# EAGLE design prototype (EAGLE 9.4.2)
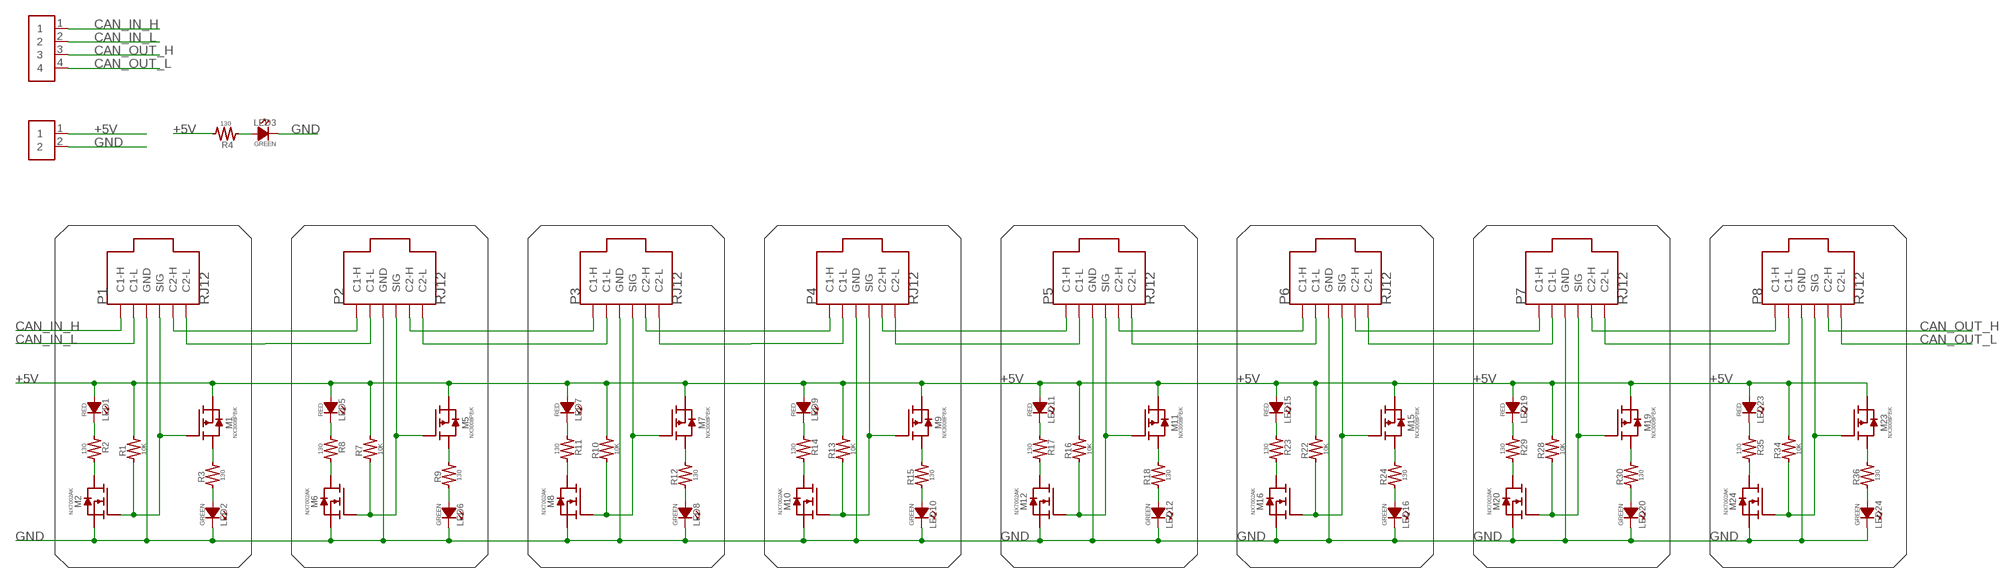
[diagram p0: schematic, sheet 1]

## Parts
LED1  RED  150060RS75000  [0603-LED]
LED2  GREEN  150060VS75000  [0603-LED]
LED3  GREEN  150060VS75000  [0603-LED]
LED5  RED  150060RS75000  [0603-LED]
LED6  GREEN  150060VS75000  [0603-LED]
LED7  RED  150060RS75000  [0603-LED]
LED8  GREEN  150060VS75000  [0603-LED]
LED9  RED  150060RS75000  [0603-LED]
LED10  GREEN  150060VS75000  [0603-LED]
LED11  RED  150060RS75000  [0603-LED]
LED12  GREEN  150060VS75000  [0603-LED]
LED15  RED  150060RS75000  [0603-LED]
LED16  GREEN  150060VS75000  [0603-LED]
LED19  RED  150060RS75000  [0603-LED]
LED20  GREEN  150060VS75000  [0603-LED]
LED23  RED  150060RS75000  [0603-LED]
LED24  GREEN  150060VS75000  [0603-LED]
M1  NX3008PBK  [SOT23]
M2  NX7002AK  [SOT23]
M5  NX3008PBK  [SOT23]
M6  NX7002AK  [SOT23]
M7  NX3008PBK  [SOT23]
M8  NX7002AK  [SOT23]
M9  NX3008PBK  [SOT23]
M10  NX7002AK  [SOT23]
M11  NX3008PBK  [SOT23]
M12  NX7002AK  [SOT23]
M15  NX3008PBK  [SOT23]
M16  NX7002AK  [SOT23]
M19  NX3008PBK  [SOT23]
M20  NX7002AK  [SOT23]
M23  NX3008PBK  [SOT23]
M24  NX7002AK  [SOT23]
P1  RJ12  [RJ12]
P2  RJ12  [RJ12]
P3  RJ12  [RJ12]
P4  RJ12  [RJ12]
P5  RJ12  [RJ12]
P6  RJ12  [RJ12]
P7  RJ12  [RJ12]
P8  RJ12  [RJ12]
R1  10K  10K0402  [0402]
R2  130  1300402  [0402]
R3  130  1300402  [0402]
R4  130  1300402  [0402]
R7  10K  10K0402  [0402]
R8  130  1300402  [0402]
R9  130  1300402  [0402]
R10  10K  10K0402  [0402]
R11  130  1300402  [0402]
R12  130  1300402  [0402]
R13  10K  10K0402  [0402]
R14  130  1300402  [0402]
R15  130  1300402  [0402]
R16  10K  10K0402  [0402]
R17  130  1300402  [0402]
R18  130  1300402  [0402]
R22  10K  10K0402  [0402]
R23  130  1300402  [0402]
R24  130  1300402  [0402]
R28  10K  10K0402  [0402]
R29  130  1300402  [0402]
R30  130  1300402  [0402]
R34  10K  10K0402  [0402]
R35  130  1300402  [0402]
R36  130  1300402  [0402]
U$1  TERMINAL_BLOCK  [TERMINALBLOCK-4]
U$2  POWER_BLOCK  [TERMINALBLOCK-2]

## Nets
+5V: LED1.2(+) LED5.2(+) LED7.2(+) LED9.2(+) LED11.2(+) LED15.2(+) LED19.2(+) LED23.2(+) M1.2(SOURCE) M5.2(SOURCE) M7.2(SOURCE) M9.2(SOURCE) M11.2(SOURCE) M15.2(SOURCE) M19.2(SOURCE) M23.2(SOURCE) R1.2 R4.2 R7.2 R10.2 R13.2 R16.2 R22.2 R28.2 R34.2 U$2.1
CAN_IN_H: P1.1(C1-H) U$1.1
CAN_IN_L: P1.2(C1-L) U$1.2
CAN_OUT_H: P8.5(C2-H) U$1.3
CAN_OUT_L: P8.6(C2-L) U$1.4
GATE1: M1.1(GATE) M2.1(GATE) P1.4(SIG) R1.1
GATE2: M5.1(GATE) M6.1(GATE) P2.4(SIG) R7.1
GATE3: M7.1(GATE) M8.1(GATE) P3.4(SIG) R10.1
GATE4: M9.1(GATE) M10.1(GATE) P4.4(SIG) R13.1
GATE5: M11.1(GATE) M12.1(GATE) P5.4(SIG) R16.1
GATE7: M15.1(GATE) M16.1(GATE) P6.4(SIG) R22.1
GATE9: M19.1(GATE) M20.1(GATE) P7.4(SIG) R28.1
GATE11: M23.1(GATE) M24.1(GATE) P8.4(SIG) R34.1
GND: LED2.1(-) LED3.1(-) LED6.1(-) LED8.1(-) LED10.1(-) LED12.1(-) LED16.1(-) LED20.1(-) LED24.1(-) M2.2(SOURCE) M6.2(SOURCE) M8.2(SOURCE) M10.2(SOURCE) M12.2(SOURCE) M16.2(SOURCE) M20.2(SOURCE) M24.2(SOURCE) P1.3(GND) P2.3(GND) P3.3(GND) P4.3(GND) P5.3(GND) P6.3(GND) P7.3(GND) P8.3(GND) U$2.2
N$1: LED3.2(+) R4.1
N$8: M1.3(DRAIN) R3.2
N$9: LED2.2(+) R3.1
N$11: LED1.1(-) R2.1
N$12: M2.3(DRAIN) R2.2
N$15: P1.5(C2-H) P2.1(C1-H)
N$16: M7.3(DRAIN) R12.2
N$17: M5.3(DRAIN) R9.2
N$18: LED6.2(+) R9.1
N$19: LED5.1(-) R8.1
N$20: M6.3(DRAIN) R8.2
N$21: LED8.2(+) R12.1
N$22: P1.6(C2-L) P2.2(C1-L)
N$23: P2.5(C2-H) P3.1(C1-H)
N$24: P2.6(C2-L) P3.2(C1-L)
N$25: LED7.1(-) R11.1
N$26: M8.3(DRAIN) R11.2
N$27: M11.3(DRAIN) R18.2
N$28: LED12.2(+) R18.1
N$29: P3.5(C2-H) P4.1(C1-H)
N$30: P3.6(C2-L) P4.2(C1-L)
N$31: M9.3(DRAIN) R15.2
N$32: LED10.2(+) R15.1
N$33: LED9.1(-) R14.1
N$34: M10.3(DRAIN) R14.2
N$35: LED11.1(-) R17.1
N$36: M12.3(DRAIN) R17.2
N$37: P4.5(C2-H) P5.1(C1-H)
N$38: P4.6(C2-L) P5.2(C1-L)
N$51: M15.3(DRAIN) R24.2
N$52: LED16.2(+) R24.1
N$53: LED15.1(-) R23.1
N$54: M16.3(DRAIN) R23.2
N$55: P5.5(C2-H) P6.1(C1-H)
N$56: P5.6(C2-L) P6.2(C1-L)
N$67: M19.3(DRAIN) R30.2
N$68: LED20.2(+) R30.1
N$69: LED19.1(-) R29.1
N$70: M20.3(DRAIN) R29.2
N$71: P6.5(C2-H) P7.1(C1-H)
N$72: P6.6(C2-L) P7.2(C1-L)
N$83: M23.3(DRAIN) R36.2
N$84: LED24.2(+) R36.1
N$85: LED23.1(-) R35.1
N$86: M24.3(DRAIN) R35.2
N$87: P7.5(C2-H) P8.1(C1-H)
N$88: P7.6(C2-L) P8.2(C1-L)

## Library data of the parts
LED1 LED5 LED7 LED9 LED11 LED15 LED19 LED23 = components:150060RS75000
LED2 LED3 LED6 LED8 LED10 LED12 LED16 LED20 LED24 = components:150060VS75000
M1 M5 M7 M9 M11 M15 M19 M23 = components:NX3008PBK
M2 M6 M8 M10 M12 M16 M20 M24 = components:NX7002AK
P1-P8 = components:RJ12
R1 R7 R10 R13 R16 R22 R28 R34 = components:10K
R2-R4 R8 R9 R11 R12 R14 R15 R17 R18 R23 R24 R29 R30 R35 R36 = components:130
U$1 = components:TERMINAL_BLOCK
U$2 = components:POWER_BLOCK

## Board
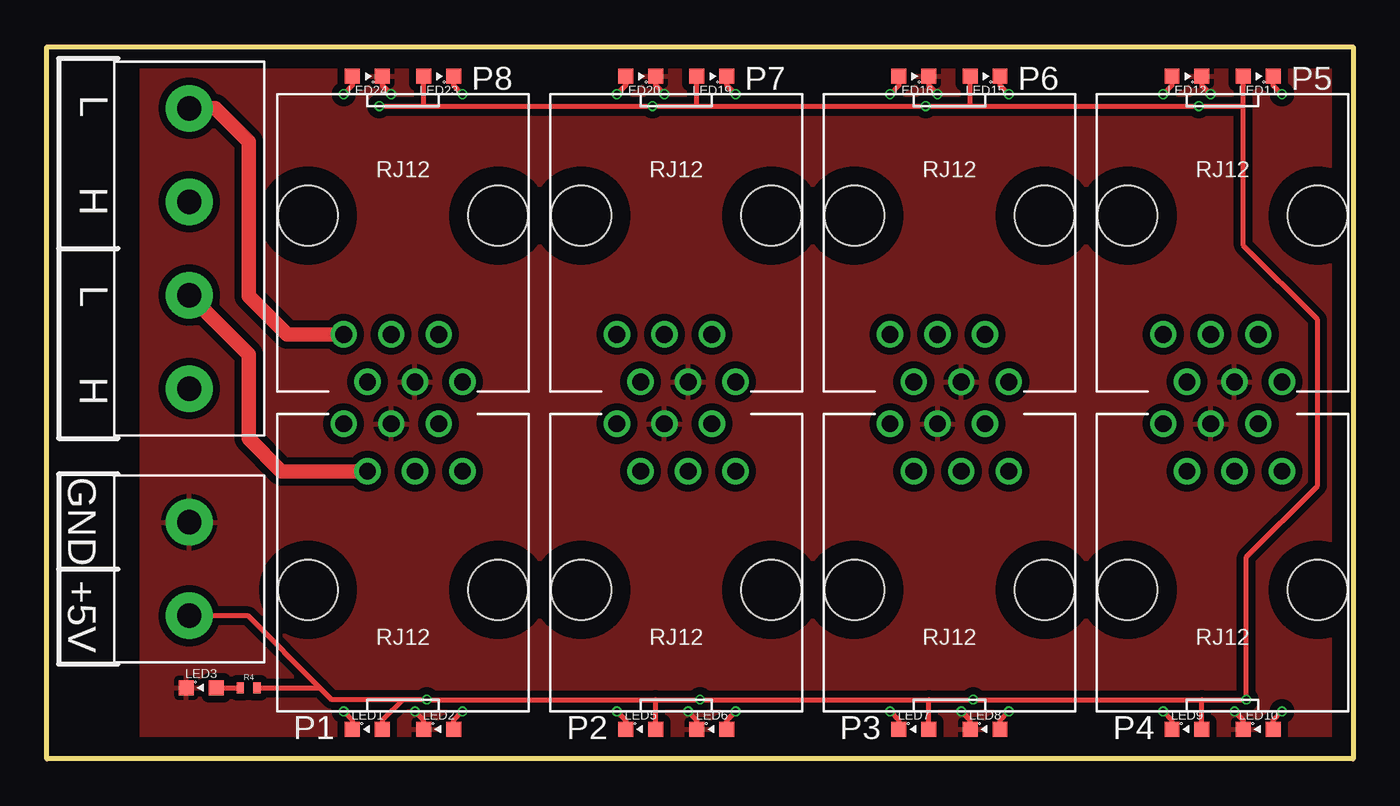
[diagram p1: board, top side]
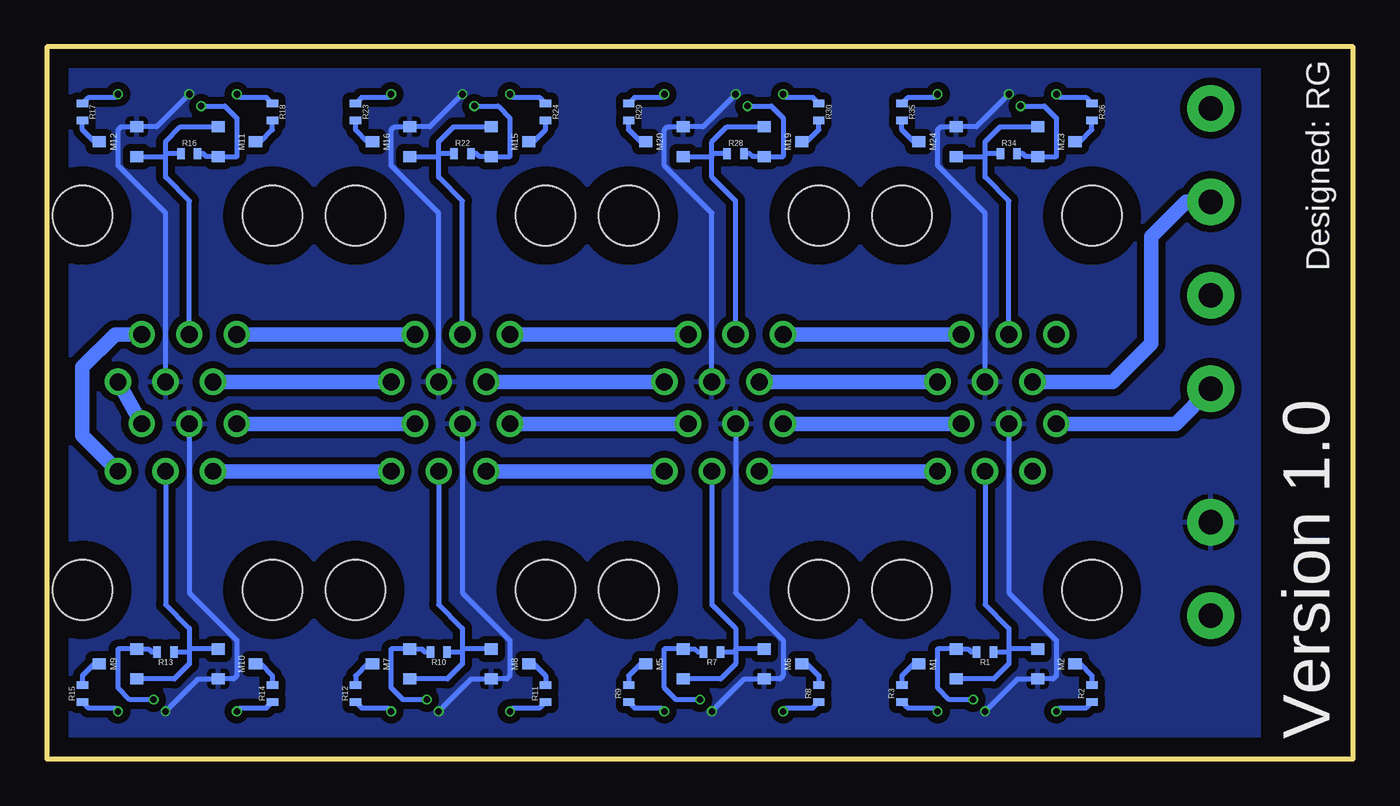
[diagram p2: board, bottom side, seen from below]

Size 69.85 x 38.1 mm. Coordinates in mm from the lower left corner, seen from the top.
Outline: 0,0 0,38.1 69.85,38.1 69.85,0 0,0
Copper layers (1*16): Top 0.035mm / dielectric 1.5mm / Bottom 0.035mm
Design rules "default *": minimum track width 6mil, minimum drill 0.35mm, track to track 6mil, track to pad 6mil, pad to pad 6mil, via to via 6mil, smd to smd 6mil, copper to edge 40mil, drill to drill 6mil, minimum pad ring 10mil, minimum via ring 1mil, stop-mask expansion 4mil, vias tented up to drill 15mil, thermal gap 10mil

### Footprints (pad centres in the part's own frame; a part is rotated, then mirrored left to right if it is on the bottom)
0603-LED = smd 0.8 x 0.8: 1 -0.8,0; 2 0.8,0
SOT23 = smd 0.6 x 0.7: 1 -0.8,-1; 2 0.8,-1; 3 0,1
RJ12 = drill 0.9: 1 3.175,-15.39; 2 1.905,-12.85; 3 0.635,-15.39; 4 -0.635,-12.85; 5 -1.905,-15.39; 6 -3.175,-12.85 | hole 3.2: -5.08,-6.5; 5.08,-6.5
0402 = smd 0.4 x 0.6: 1 -0.45,0; 2 0.45,0
TERMINALBLOCK-4 = drill 1.3 pad 2.5: 1 -7.5,0; 2 -2.5,0; 3 2.5,0; 4 7.5,0
TERMINALBLOCK-2 = drill 1.3 pad 2.5: 1 -2.5,0; 2 2.5,0

### Placement (x,y rotation side)
LED1  17.14,1.59 0 top
LED2  20.95,1.59 0 top
LED3  8.26,3.81 0 top
LED5  31.75,1.59 0 top
LED6  35.56,1.59 0 top
LED7  46.35,1.59 0 top
LED8  50.16,1.59 0 top
LED9  60.96,1.59 0 top
LED10  64.77,1.59 0 top
LED11  64.77,36.51 180 top
LED12  60.96,36.51 180 top
LED15  50.16,36.51 180 top
LED16  46.35,36.51 180 top
LED19  35.56,36.51 180 top
LED20  31.75,36.51 180 top
LED23  20.95,36.51 180 top
LED24  17.14,36.51 180 top
M1  22.23,5.08 90 bottom
M2  15.88,5.08 270 bottom
M5  36.83,5.08 90 bottom
M6  30.48,5.08 270 bottom
M7  51.44,5.08 90 bottom
M8  45.09,5.08 270 bottom
M9  66.04,5.08 90 bottom
M10  59.69,5.08 270 bottom
M11  59.69,33.02 270 bottom
M12  66.04,33.02 90 bottom
M15  45.09,33.02 270 bottom
M16  51.44,33.02 90 bottom
M19  30.48,33.02 270 bottom
M20  36.83,33.02 90 bottom
M23  15.88,33.02 270 bottom
M24  22.23,33.02 90 bottom
P1  19.05,2.54 180 top
P2  33.66,2.54 180 top
P3  48.26,2.54 180 top
P4  62.87,2.54 180 top
P5  62.87,35.56 0 top
P6  48.26,35.56 0 top
P7  33.66,35.56 0 top
P8  19.05,35.56 0 top
R1  19.68,5.71 180 bottom
R2  13.97,3.49 90 bottom
R3  24.13,3.49 90 bottom
R4  10.79,3.81 0 top
R7  34.29,5.71 180 bottom
R8  28.57,3.49 90 bottom
R9  38.73,3.49 90 bottom
R10  48.9,5.71 180 bottom
R11  43.18,3.49 90 bottom
R12  53.34,3.49 90 bottom
R13  63.5,5.71 180 bottom
R14  57.78,3.49 90 bottom
R15  67.94,3.49 90 bottom
R16  62.23,32.38 0 bottom
R17  67.94,34.61 270 bottom
R18  57.78,34.61 270 bottom
R22  47.62,32.38 0 bottom
R23  53.34,34.61 270 bottom
R24  43.18,34.61 270 bottom
R28  33.02,32.38 0 bottom
R29  38.73,34.61 270 bottom
R30  28.57,34.61 270 bottom
R34  18.41,32.38 0 bottom
R35  24.13,34.61 270 bottom
R36  13.97,34.61 270 bottom
U$1  7.62,27.3 90 top
U$2  7.62,10.16 90 top

### Tracks (layer width: path | path; a pad name or v marks a point on that pad's centre or on a via)
+5V  (via drill 0.35)
  Top 0.254: 18.1,1.74 LED1.2 17.95,2.07 19.05,3.17 | 19.05,3.17 v20.32,3.17 32.55,3.17 | 32.55,3.17 v34.92,3.17 47.16,3.17 | LED5.2 32.55,3.17 | 47.16,3.17 v49.53,3.17 61.76,3.17 | 61.76,3.17 v64.14,3.17 64.14,10.79 67.94,14.61 67.94,23.5 63.97,27.47 63.97,34.92 | LED9.2 61.76,3.17 | LED7.2 47.16,3.17 | v17.78,34.92 20.16,34.92 | 20.16,34.92 LED23.2 | 20.16,34.92 v32.38,34.92 34.76,34.92 | 34.76,34.92 LED19.2 | 34.76,34.92 v46.99,34.92 49.37,34.92 | 49.37,34.92 LED15.2 | 49.37,34.92 v61.59,34.92 63.97,34.92 | 63.97,36.03 LED11.2 63.97,34.92 | U$2.1 7.6,7.64 10.78,7.64 14.61,3.81 | 19.05,3.17 15.24,3.17 14.61,3.81 | R4.2 14.61,3.81
  Bottom 0.254: R1.2 20.43,5.71 20.59,5.88 M1.2 22.23,5.88 22.23,3.81 21.59,3.17 v20.32,3.17 | R7.2 35.03,5.71 35.2,5.88 M5.2 36.83,5.88 36.83,3.81 36.2,3.17 v34.92,3.17 | R10.2 49.63,5.71 49.8,5.88 M7.2 51.44,5.88 51.44,3.81 50.8,3.17 v49.53,3.17 | R13.2 64.24,5.71 64.41,5.88 M9.2 66.04,5.88 66.04,3.81 65.41,3.17 v64.14,3.17 | R16.2 61.49,32.38 61.33,32.22 M11.2 59.69,32.22 59.69,34.29 60.33,34.92 v61.59,34.92 | R22.2 46.88,32.38 46.72,32.22 M15.2 45.09,32.22 45.09,34.29 45.72,34.92 v46.99,34.92 | R28.2 32.28,32.38 32.12,32.22 M19.2 30.48,32.22 30.48,34.29 31.11,34.92 v32.38,34.92 | R34.2 17.68,32.38 17.51,32.22 M23.2 15.88,32.22 15.88,34.29 16.51,34.92 v17.78,34.92
CAN_IN_H
  Bottom 0.762: U$1.1 9.49,17.93 P1.1
CAN_IN_L
  Top 0.762: U$1.2 10.79,21.63 10.79,17.14 12.55,15.39 P1.2
CAN_OUT_H
  Bottom 0.762: U$1.3 8.93,29.8 10.79,27.94 10.79,22.23 12.85,20.17 P8.5
CAN_OUT_L
  Top 0.762: U$1.4 9.01,34.8 10.79,33.02 10.79,24.77 12.85,22.71 P8.6
GATE1
  Bottom 0.254: R1.1 18.41,5.71 | M2.1 18.41,5.88 | 18.41,5.88 18.41,5.71 | 18.41,5.71 18.41,5.08 19.21,4.28 M1.1 | P1.4 19.68,8.26 18.41,6.99 18.41,5.88
GATE2
  Bottom 0.254: R7.1 33.02,5.71 | M6.1 33.02,5.88 | 33.02,5.88 33.02,5.71 | 33.02,5.71 33.02,5.08 33.82,4.28 M5.1 | P2.4 34.29,8.26 33.02,6.99 33.02,5.88
GATE3
  Bottom 0.254: R10.1 47.62,5.71 | M8.1 47.62,5.88 | 47.62,5.88 47.62,5.71 | 47.62,5.71 47.62,5.08 48.42,4.28 M7.1 | P3.4 48.9,8.26 47.62,6.99 47.62,5.88
GATE4
  Bottom 0.254: R13.1 62.23,5.71 | M10.1 62.23,5.88 | 62.23,5.88 62.23,5.71 | 62.23,5.71 62.23,5.08 63.03,4.28 M9.1 | P4.4 63.5,8.26 62.23,6.99 62.23,5.88
GATE5
  Bottom 0.254: R16.1 63.5,32.38 | M12.1 63.5,32.22 | 63.5,32.22 63.5,32.38 | 63.5,32.38 63.5,33.02 62.7,33.82 M11.1 | P5.4 62.23,29.84 63.5,31.11 63.5,32.22
GATE7
  Bottom 0.254: R22.1 48.9,32.38 | M16.1 48.9,32.22 | 48.9,32.22 48.9,32.38 | 48.9,32.38 48.9,33.02 48.09,33.82 M15.1 | P6.4 47.62,29.84 48.9,31.11 48.9,32.22
GATE9
  Bottom 0.254: R28.1 34.29,32.38 | M20.1 34.29,32.22 | 34.29,32.22 34.29,32.38 | 34.29,32.38 34.29,33.02 33.49,33.82 M19.1 | P7.4 33.02,29.84 34.29,31.11 34.29,32.22
GATE11
  Bottom 0.254: R34.1 19.68,32.38 | M24.1 19.68,32.22 | 19.68,32.22 19.68,32.38 | 19.68,32.38 19.68,33.02 18.89,33.82 M23.1 | P8.4 18.41,29.84 19.68,31.11 19.68,32.22
GND  (via drill 0.35)
  Top 0.254: LED2.1 20.16,2.07 v19.68,2.54 | LED6.1 34.76,2.07 v34.29,2.54 | LED8.1 49.37,2.07 v48.9,2.54 | LED10.1 63.97,2.07 v63.5,2.54 | LED12.1 61.76,36.03 v62.23,35.56 | LED16.1 47.16,36.03 v47.62,35.56 | LED20.1 32.55,36.03 v33.02,35.56 | LED24.1 17.95,36.03 v18.41,35.56
  Bottom 0.254: v19.68,2.54 17.95,4.28 M2.2 16.04,4.28 15.88,4.45 15.88,6.35 18.41,8.89 P1.3 | v34.29,2.54 32.55,4.28 M6.2 30.64,4.28 30.48,4.45 30.48,6.35 33.02,8.89 P2.3 | v48.9,2.54 47.16,4.28 M8.2 45.25,4.28 45.09,4.45 45.09,6.35 47.62,8.89 P3.3 | v63.5,2.54 61.76,4.28 M10.2 59.85,4.28 59.69,4.45 59.69,6.35 62.23,8.89 P4.3 | v62.23,35.56 63.97,33.82 M12.2 65.88,33.82 66.04,33.66 66.04,31.75 63.5,29.21 P5.3 | v47.62,35.56 49.37,33.82 M16.2 51.27,33.82 51.44,33.66 51.44,31.75 48.9,29.21 P6.3 | v33.02,35.56 34.76,33.82 M20.2 36.66,33.82 36.83,33.66 36.83,31.75 34.29,29.21 P7.3 | v18.41,35.56 20.16,33.82 M24.2 22.06,33.82 22.23,33.66 22.23,31.75 19.68,29.21 P8.3
  pour Top (isolate 0.381): 5.08,38.1 5.08,0 69.85,0 69.85,38.1
  pour Bottom (isolate 0.381): 5.08,38.1 5.08,0 69.85,0 69.85,38.1
N$1
  Top 0.254: LED3.2 R4.1
N$8
  Bottom 0.254: M1.3 23.5,5.08 24.13,4.45 R3.2
N$9  (via drill 0.35)
  Top 0.254: LED2.2 21.75,2.07 v22.23,2.54
  Bottom 0.254: v22.23,2.54 22.41,2.73 23.81,2.73 R3.1
N$11  (via drill 0.35)
  Top 0.254: v15.88,2.54 16.34,2.07 LED1.1
  Bottom 0.254: R2.1 14.29,2.73 15.69,2.73 v15.88,2.54
N$12
  Bottom 0.254: M2.3 14.61,5.08 13.97,4.45 R2.2
N$15
  Bottom 0.762: P1.5 P2.1
N$16
  Bottom 0.254: M7.3 52.7,5.08 53.34,4.45 R12.2
N$17
  Bottom 0.254: M5.3 38.1,5.08 38.73,4.45 R9.2
N$18  (via drill 0.35)
  Top 0.254: LED6.2 36.36,2.07 v36.83,2.54
  Bottom 0.254: v36.83,2.54 37.02,2.73 38.42,2.73 R9.1
N$19  (via drill 0.35)
  Top 0.254: v30.48,2.54 30.95,2.07 LED5.1
  Bottom 0.254: R8.1 28.89,2.73 30.3,2.73 v30.48,2.54
N$20
  Bottom 0.254: M6.3 29.21,5.08 28.57,4.45 R8.2
N$21  (via drill 0.35)
  Top 0.254: LED8.2 50.97,2.07 v51.44,2.54
  Bottom 0.254: v51.44,2.54 51.62,2.73 53.02,2.73 R12.1
N$22
  Bottom 0.762: P1.6 P2.2
N$23
  Bottom 0.762: P2.5 P3.1
N$24
  Bottom 0.762: P2.6 P3.2
N$25  (via drill 0.35)
  Top 0.254: v45.09,2.54 45.55,2.07 LED7.1
  Bottom 0.254: R11.1 43.5,2.73 44.9,2.73 v45.09,2.54
N$26
  Bottom 0.254: M8.3 43.81,5.08 43.18,4.45 R11.2
N$27
  Bottom 0.254: M11.3 58.42,33.02 57.78,33.66 R18.2
N$28  (via drill 0.35)
  Top 0.254: LED12.2 60.16,36.03 v59.69,35.56
  Bottom 0.254: v59.69,35.56 59.51,35.38 58.1,35.38 R18.1
N$29
  Bottom 0.762: P3.5 P4.1
N$30
  Bottom 0.762: P3.6 P4.2
N$31
  Bottom 0.254: M9.3 67.31,5.08 67.94,4.45 R15.2
N$32  (via drill 0.35)
  Top 0.254: LED10.2 65.57,2.07 v66.04,2.54
  Bottom 0.254: v66.04,2.54 66.22,2.73 67.63,2.73 R15.1
N$33  (via drill 0.35)
  Top 0.254: v59.69,2.54 60.16,2.07 LED9.1
  Bottom 0.254: R14.1 58.1,2.73 59.51,2.73 v59.69,2.54
N$34
  Bottom 0.254: M10.3 58.42,5.08 57.78,4.45 R14.2
N$35  (via drill 0.35)
  Top 0.254: v66.04,35.56 65.57,36.03 LED11.1
  Bottom 0.254: R17.1 67.63,35.38 66.22,35.38 v66.04,35.56
N$36
  Bottom 0.254: M12.3 67.31,33.02 67.94,33.66 R17.2
N$37
  Bottom 0.762: P5.1 P4.5
N$38
  Bottom 0.762: P4.6 67.94,17.3 67.94,20.95 66.19,22.71 P5.2
N$51
  Bottom 0.254: M15.3 43.81,33.02 43.18,33.66 R24.2
N$52  (via drill 0.35)
  Top 0.254: LED16.2 45.55,36.03 v45.09,35.56
  Bottom 0.254: v45.09,35.56 44.9,35.38 43.5,35.38 R24.1
N$53  (via drill 0.35)
  Top 0.254: v51.44,35.56 50.97,36.03 LED15.1
  Bottom 0.254: R23.1 53.02,35.38 51.62,35.38 v51.44,35.56
N$54
  Bottom 0.254: M16.3 52.7,33.02 53.34,33.66 R23.2
N$55
  Bottom 0.762: P5.5 P6.1
N$56
  Bottom 0.762: P5.6 P6.2
N$67
  Bottom 0.254: M19.3 29.21,33.02 28.57,33.66 R30.2
N$68  (via drill 0.35)
  Top 0.254: LED20.2 30.95,36.03 v30.48,35.56
  Bottom 0.254: v30.48,35.56 30.3,35.38 28.89,35.38 R30.1
N$69  (via drill 0.35)
  Top 0.254: v36.83,35.56 36.36,36.03 LED19.1
  Bottom 0.254: R29.1 38.42,35.38 37.02,35.38 v36.83,35.56
N$70
  Bottom 0.254: M20.3 38.1,33.02 38.73,33.66 R29.2
N$71
  Bottom 0.762: P6.5 P7.1
N$72
  Bottom 0.762: P6.6 P7.2
N$83
  Bottom 0.254: M23.3 14.61,33.02 13.97,33.66 R36.2
N$84  (via drill 0.35)
  Top 0.254: LED24.2 16.34,36.03 v15.88,35.56
  Bottom 0.254: v15.88,35.56 15.69,35.38 14.29,35.38 R36.1
N$85  (via drill 0.35)
  Top 0.254: v22.23,35.56 21.75,36.03 LED23.1
  Bottom 0.254: R35.1 23.81,35.38 22.41,35.38 v22.23,35.56
N$86
  Bottom 0.254: M24.3 23.5,33.02 24.13,33.66 R35.2
N$87
  Bottom 0.762: P8.1 P7.5
N$88
  Bottom 0.762: P7.6 P8.2

### Text on the board
tPlace: L | H | L | H | GND | +5V
bPlace: Designed: RG | Version 1.0